# EAGLE schematic IPIX_V2 (EAGLE 7.6.0)
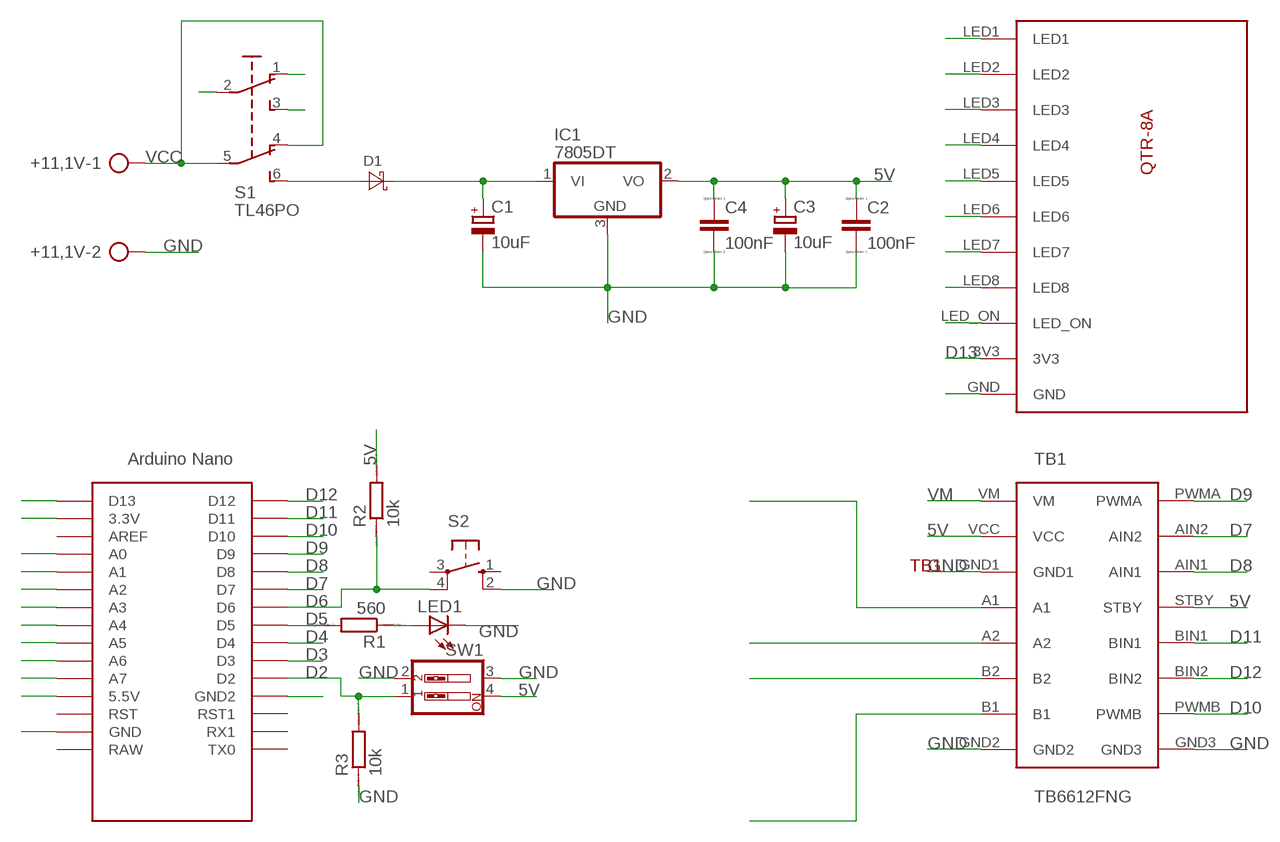
[diagram p0: schematic, sheet 1]

## Parts
+11,1V  AK500/2-H  [AK500/2-H]
C1  10uF  CPOL-EUE2,5-6E  [E2,5-6E]
C2  100nF  C  [C0805]
C3  10uF  CPOL-EUE2,5-6E  [E2,5-6E]
C4  100nF  C  [C0805]
D1  DIODE-SCHOTTKY-DO201AD  [DO201AD]
IC1  7805DT  [TO252]
LED1  LED3MM  [LED3MM]
R1  560  R0204/7  [0204/7]
R2  10k  R  [R0805]
R3  10k  R  [R0805]
S1  TL46PO  [TL4XPO]
S2  10-XX  [B3F-10XX]
SW1  SW_DIP-2  [EDG-02]
TB1  TB6612FNG  [TB6612FNG]
U$1  NANO  [NANO]
U$2  QTR-8A  [QTR-8A]

## Nets
3,3V: U$1.3.3V
5V: C2.1 C3.+ C4.1 IC1.2(VO) R2.2 SW1.4 TB1.STBY TB1.VCC U$1.5V(5.5V) U$2.LED8
A0: U$1.A0 U$2.LED_ON
A1: U$1.A1 U$2.LED1
A2: U$1.A2 U$2.LED2
A3: U$1.A3 U$2.LED3
A4: U$1.A4 U$2.LED4
A5: U$1.A5 U$2.LED5
A6: U$1.A6 U$2.LED6
A7: U$1.A7 U$2.LED7
D2: R3.2 SW1.1 U$1.D2
D3: U$1.D3
D4: U$1.D4
D5: R1.2 U$1.D5
D6: R2.1 S2.4(P1) U$1.D6
D7: TB1.AIN2 U$1.D7
D8: TB1.AIN1 U$1.D8
D9: TB1.PWMA U$1.D9
D10: TB1.PWMB U$1.D10
D11: TB1.BIN1 U$1.D11
D12: TB1.BIN2 U$1.D12
D13: U$1.D13 U$2.3V3
GND: +11,1V.2 C1.- C2.2 C3.- C4.2 IC1.3(GND) LED1.K(C) R3.1 S1.1(O) S1.2(P) S1.3(S) S2.2(S1) SW1.2 SW1.3 TB1.GND1 TB1.GND2 TB1.GND3 U$1.GND U$1.GND1(GND2) U$2.GND
N$2: D1.A S1.6(S1)
N$3: TB1.A1
N$4: TB1.A2
N$11: LED1.A R1.1
N$21: TB1.B2
N$25: TB1.B1
VCC: +11,1V.1 S1.4(O1) S1.5(P1)
VM: C1.+ D1.C IC1.1(VI) TB1.VM
Unconnected: S2.1(S) S2.3(P) U$1.AREF U$1.ICSP1 U$1.ICSP2 U$1.ICSP3 U$1.ICSP4 U$1.ICSP5 U$1.ICSP6 U$1.RAW U$1.RST U$1.RST1 U$1.RX1 U$1.TX0

## Library data of the parts
+11,1V = con-ptr500:AK500/2-H: CONNECTOR Aug. 2004 / PTR Meßtechnik: Die Bezeichnung der Serie AK505 wurde geändert. Es handelt sich hierbei um AK500 in horizontaler Ausführung.; OC_FARNELL: unknown; OC_NEWARK: unknown
C1 C3 = rcl:CPOL-EU: POLARIZED CAPACITOR, European symbol
C2 C4 = eagle-ltspice:C: CAPACITOR, European symbol; SPICEMODEL: NONE; SPICEPREFIX: C
D1 = diode (2):DIODE-SCHOTTKY-: SCHOTTKY DIODE
IC1 = linear:78*: Positive VOLTAGE REGULATOR Source: http://cache.national.com/ds/LM/LM78L05.pdf http://www.fairchildsemi.com/ds/LM/LM7805.pdf
LED1 = led:LED: LED OSRAM: - CHIPLED LG R971, LG N971, LY N971, LG Q971, LY Q971, LO R971, LY R971 LH N974, LH R974 LS Q976, LO Q976, LY Q976 LO Q996 - Hyper CHIPLED LW Q18S LB Q993, LB Q99A, LB R99A - SideLED LS A670, LO A670, LY A670, LG A670, LP A670 LB A673, LV A673, LT A673, LW A673 LH A674 LY A675 LS A676, LA A676, LO A676, LY A676, LW A676 LS A679, LY A679, LG A679 - Hyper Micro SIDELED® LS Y876, LA Y876, LO Y876, LY Y876 LT Y87S - SmartLED LW L88C, LW L88S LB L89C, LB L89S, LG L890 LS L89K, LO L89K, LY L89K LS L896, LA L896, LO L896, LY L896 - TOPLED LS T670, LO T670, LY T670, LG T670, LP T670 LSG T670, LSP T670, LSY T670, LOP T670, LYG T670 LG T671, LOG T671, LSG T671 LB T673, LV T673, LT T673, LW T673 LH T674 LS T676, LA T676, LO T676, LY T676, LB T676, LH T676, LSB T676, LW T676 LB T67C, LV T67C, LT T67C, LS T67K, LO T67K, LY T67K, LW E67C LS E67B, LA E67B, LO E67B, LY E67B, LB E67C, LV E67C, LT E67C LW T67C LS T679, LY T679, LG T679 LS T770, LO T770, LY T770, LG T770, LP T770 LB T773, LV T773, LT T773, LW T773 LH T774 LS E675, LA E675, LY E675, LS T675 LS T776, LA T776, LO T776, LY T776, LB T776 LHGB T686 LT T68C, LB T68C - Hyper Mini TOPLED® LB M676 - Mini TOPLED Santana® LG M470 LS M47K, LO M47K, LY M47K Source: http://www.osram.convergy.de LUXEON: - LUMILED® LXK2-PW12-R00, LXK2-PW12-S00, LXK2-PW14-U00, LXK2-PW14-V00 LXK2-PM12-R00, LXK2-PM12-S00, LXK2-PM14-U00 LXK2-PE12-Q00, LXK2-PE12-R00, LXK2-PE12-S00, LXK2-PE14-T00, LXK2-PE14-U00 LXK2-PB12-K00, LXK2-PB12-L00, LXK2-PB12-M00, LXK2-PB14-N00, LXK2-PB14-P00, LXK2-PB14-Q00 LXK2-PR12-L00, LXK2-PR12-M00, LXK2-PR14-Q00, LXK2-PR14-R00 LXK2-PD12-Q00, LXK2-PD12-R00, LXK2-PD12-S00 LXK2-PH12-R00, LXK2-PH12-S00 LXK2-PL12-P00, LXK2-PL12-Q00, LXK2-PL12-R00 Source: www.luxeon.com KINGBRIGHT: KA-3528ASYC Source: www.kingbright.com
R1-R3 = eagle-ltspice:R: RESISTOR, European symbol; SPICEMODEL: NONE; SPICEPREFIX: R
S1 = switch:TL46PO: TINY SWITCH ON - ON Source: http://www2.produktinfo.conrad.com/datenblaetter/700000-724999/705152-da-01-de-Subminiaturschalter_TL_36YO.pdf
S2 = switch-omron:10-XX: OMRON SWITCH; MPN: B3F-1000; OC_FARNELL: 176432; OC_NEWARK: 36M3542
SW1 = special:SW_DIP-2: DIP SWITCH
TB1 = TB6612FNG:TB6612FNG
U$1 = Arduino-clone:NANO: Arduino Nano
U$2 = QTR-8APINES:QTR-8A: Check availability <https://pricing.snapeda.com/parts/QTR-8A/Pololu/view-part?ref=eda>; AVAILABILITY: Not in stock; CHECK_PRICES: https://www.snapeda.com/parts/QTR-8A/Pololu/view-part/?ref=eda; DESCRIPTION: QRE1113GR series Phototransistor Sensor Evaluation Board; MF: Pololu; MP: QTR-8A; PACKAGE: None; PRICE: None; SNAPEDA_LINK: https://www.snapeda.com/parts/QTR-8A/Pololu/view-part/?ref=snap